# EAGLE design fishnet-0.5 (EAGLE 6.2)
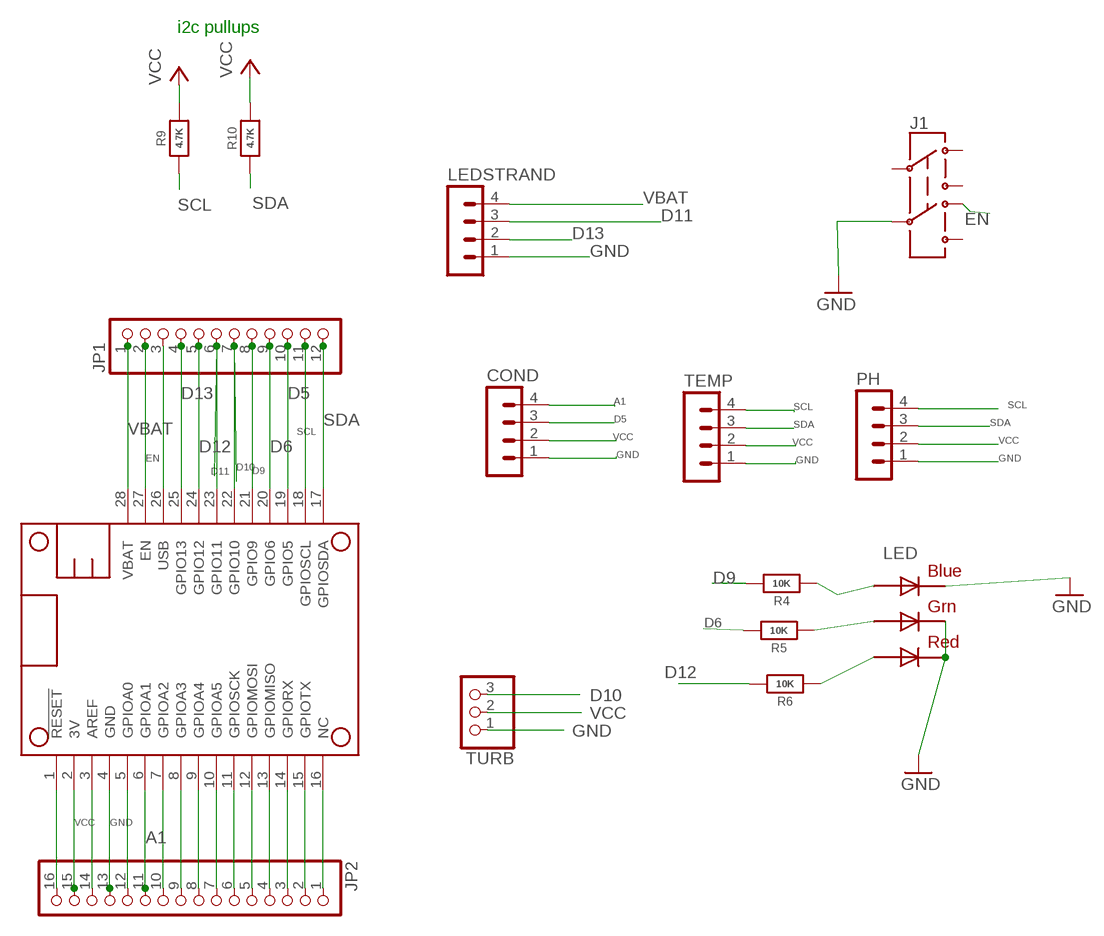
[diagram p0: schematic, sheet 1]

## Parts
COND  MA04-1  [MA04-1]
J1  AYZ0202  [AYZ0202]
JP1  PINHD-1X12  [1X12]
JP2  PINHD-1X16  [1X16]
LED  RGBLED5050  [RGBLED5050]
LEDSTRAND  MA04-1  [MA04-1]
MS1  FEATHERWING  [FEATHERWING]
PH  MA04-1  [MA04-1]
R4  10K  RESISTOR_0603_NOOUT  [0603-NO]
R5  10K  RESISTOR_0603_NOOUT  [0603-NO]
R6  10K  RESISTOR_0603_NOOUT  [0603-NO]
R9  4.7K  RESISTOR_0603_NOOUT  [0603-NO]
R10  4.7K  RESISTOR_0603_NOOUT  [0603-NO]
TEMP  MA04-1  [MA04-1]
TURB  PINHD-1X3  [1X03]

## Nets
A1: COND.4 JP2.11 MS1.6(GPIOA1)
D5: COND.3 JP1.10 MS1.19(GPIO5)
D6: JP1.9 MS1.20(GPIO6) R5.2
D9: JP1.8 MS1.21(GPIO9) R4.2
D10: JP1.7 MS1.22(GPIO10) TURB.3
D11: JP1.6 LEDSTRAND.3 MS1.23(GPIO11)
D12: JP1.5 MS1.24(GPIO12) R6.2
D13: JP1.4 LEDSTRAND.2 MS1.25(GPIO13)
EN: J1.6 JP1.2 MS1.27(EN)
GND: COND.1 J1.5 JP2.13 LED.4(BLUE_C) LED.5(RED_C) LED.6(GREEN_C) LEDSTRAND.1 MS1.4(GND) PH.1 TEMP.1 TURB.1
N$1: LED.2(RED_A) R6.1
N$2: JP2.1 MS1.16(NC)
N$3: JP2.2 MS1.15(GPIOTX)
N$4: JP2.3 MS1.14(GPIORX)
N$5: JP2.4 MS1.13(GPIOMISO)
N$6: JP2.5 MS1.12(GPIOMOSI)
N$7: JP2.6 MS1.11(GPIOSCK)
N$8: JP2.7 MS1.10(GPIOA5)
N$9: JP2.8 MS1.9(GPIOA4)
N$10: JP2.9 MS1.8(GPIOA3)
N$11: JP2.10 MS1.7(GPIOA2)
N$12: JP2.12 MS1.5(GPIOA0)
N$13: JP2.14 MS1.3(AREF)
N$14: JP2.16 MS1.1(!RESET)
N$22: LED.3(BLUE_A) R4.1
N$23: LED.1(GREEN_A) R5.1
SCL: JP1.11 MS1.18(GPIOSCL) PH.4 R9.1 TEMP.4
SDA: JP1.12 MS1.17(GPIOSDA) PH.3 R10.1 TEMP.3
USB: JP1.3 MS1.26(USB)
VBAT: JP1.1 LEDSTRAND.4 MS1.28(VBAT)
VCC: COND.2 JP2.15 MS1.2(3V) PH.2 R9.2 R10.2 TEMP.2 TURB.2
Unconnected: J1.1 J1.2 J1.3 J1.4

## Notes on the sheet
- i2c pullups

## Library data of the parts
COND LEDSTRAND PH TEMP = con-lstb:MA04-1: PIN HEADER; OC_FARNELL: unknown; OC_NEWARK: unknown
J1 = SparkFunNew:AYZ0202: SPDT Slide Switch Simple SMD single-pull double-throw slide switch. Good for less than 350mA power switch, switching UARTs between devices, etc. Spark Fun Electronics SKU : COM-00597
JP1 = pinhead:PINHD-1X12: PIN HEADER
JP2 = pinhead:PINHD-1X16: PIN HEADER
LED = adafruit:RGBLED: For 5050 RGB LEDs, the order of the LEDs may vary from one manufacturer to another!
MS1 = adafruit:FEATHERWING
R4-R6 R9 R10 = microbuilder:RESISTOR: Resistors For new designs, use the packages preceded by an '_' character since they are more reliable: The following footprints should be used on most boards: _0402 - Standard footprint for regular board layouts _0603 - Standard footprint for regular board layouts _0805 - Standard footprint for regular board layouts _1206 - Standard footprint for regular board layouts For extremely tight-pitch boards where space is at a premium, the following 'micro-pitch' footprints can be used (smaller pads, no silkscreen outline, etc.): _0402MP - Micro-pitch footprint for very dense/compact boards _0603MP - Micro-pitch footprint for very dense/compact boards _0805MP - Micro-pitch footprint for very dense/compact boards _1206MP - Micro-pitch footprint for very dense/compact boards
TURB = pinhead:PINHD-1X3: PIN HEADER

## Board
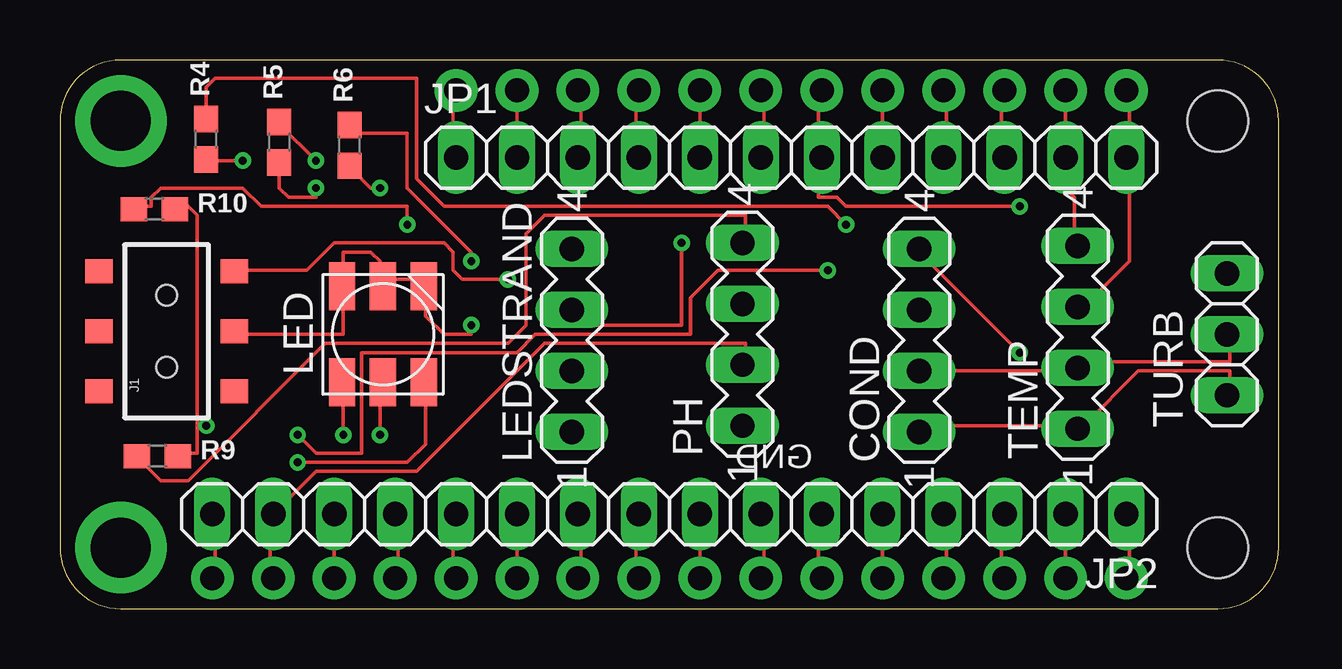
[diagram p1: board, top side]
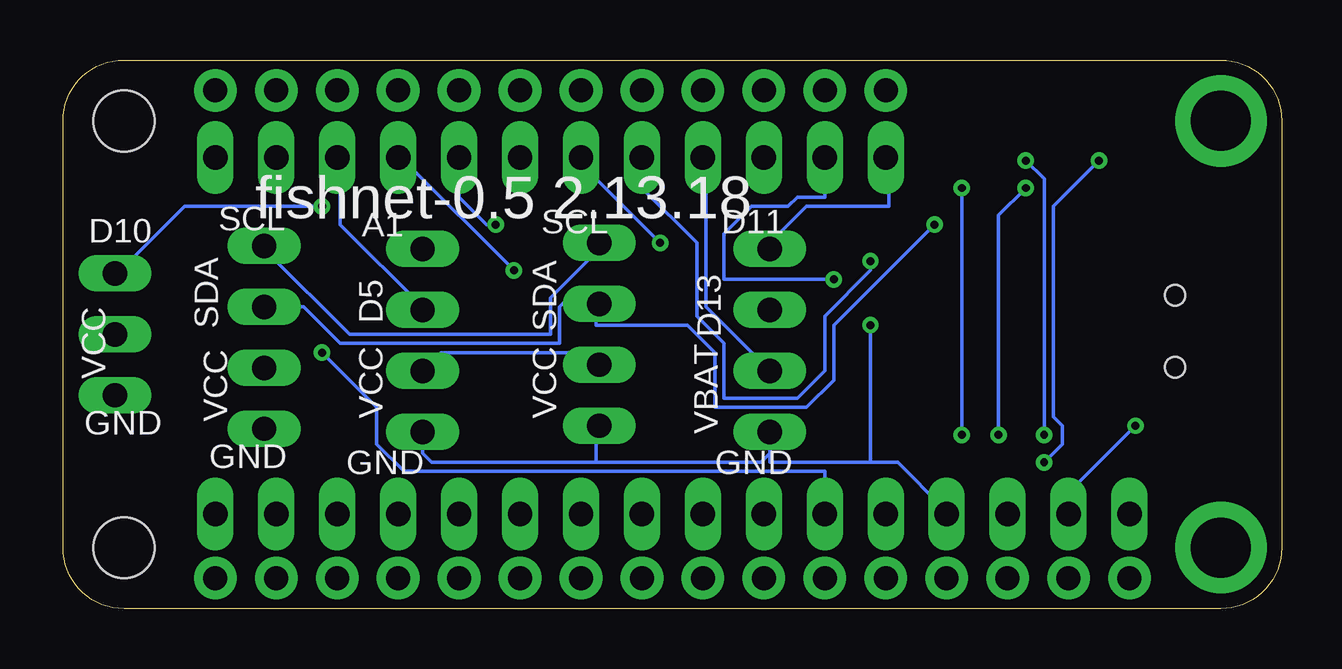
[diagram p2: board, bottom side, seen from below]

Size 50.8 x 22.86 mm. Coordinates in mm from the lower left corner, seen from the top.
Copper layers (1*16): Top 0.0356mm / dielectric 1.5011mm / Bottom 0.0356mm
Design rules: minimum track width 6mil, minimum drill 13mil, track to track 6mil, track to pad 6mil, pad to pad 6mil, via to via 6mil, smd to smd 6mil, copper to edge 15mil, drill to drill 6mil, minimum pad ring 7mil, minimum via ring 7mil, stop-mask expansion 2.5mil, vias tented up to drill 0mil, thermal gap 10mil
vRestrict: area 10.2,7.6 to 16.8,15.5; area 5.1,17.8 to 7.1,21.3; area 8.1,17.5 to 10.2,21.3; area 11.2,17 to 13,21.3; area 19.3,6.1 to 23.4,16.3; area 26.4,6.1 to 30.5,16.5; area 34,5.8 to 37.8,16.3; area 40.4,6.1 to 44.5,16.3; area 47,6.6 to 50.3,15.5; area 0.5,7.6 to 2.8,15.2; area 6.3,7.9 to 8.4,15.2; area 2,15.7 to 5.8,17.5; area 2,5.3 to 6.9,7.1

### Footprints (pad centres in the part's own frame; a part is rotated, then mirrored left to right if it is on the bottom)
MA04-1 = drill 1.016 long: 1 -3.81,0; 2 -1.27,0; 3 1.27,0; 4 3.81,0
AYZ0202 = smd 1 x 1.15: 1 -2.5,2.825; 2 0,2.825; 3 2.5,2.825; 4 -2.5,-2.825; 5 0,-2.825; 6 2.5,-2.825 | hole 0.85: 1.5,0; -1.5,0
1X12 = drill 1.016 long: 1 -13.97,0; 2 -11.43,0; 3 -8.89,0; 4 -6.35,0; 5 -3.81,0; 6 -1.27,0; 7 1.27,0; 8 3.81,0; 9 6.35,0; 10 8.89,0; 11 11.43,0; 12 13.97,0
1X16 = drill 1.016 long: 1 -19.05,0; 2 -16.51,0; 3 -13.97,0; 4 -11.43,0; 5 -8.89,0; 6 -6.35,0; 7 -3.81,0; 8 -1.27,0; 9 1.27,0; 10 3.81,0; 11 6.35,0; 12 8.89,0; 13 11.43,0; 14 13.97,0; 15 16.51,0; 16 19.05,0
RGBLED5050 = smd 2 x 1.1: 1 -2,1.7; 2 -2,0; 3 -2,-1.7; 4 2,-1.7; 5 2,0; 6 2,1.7
FEATHERWING = drill 1 pad 1.778: 1 6.35,1.27; 2 8.89,1.27; 3 11.43,1.27; 4 13.97,1.27; 5 16.51,1.27; 6 19.05,1.27; 7 21.59,1.27; 8 24.13,1.27; 9 26.67,1.27; 10 29.21,1.27; 11 31.75,1.27; 12 34.29,1.27; 13 36.83,1.27; 14 39.37,1.27; 15 41.91,1.27; 16 44.45,1.27; 17 44.45,21.59; 18 41.91,21.59; 19 39.37,21.59; 20 36.83,21.59; 21 34.29,21.59; 22 31.75,21.59; 23 29.21,21.59; 24 26.67,21.59; 25 24.13,21.59; 26 21.59,21.59; 27 19.05,21.59; 28 16.51,21.59 | drill 2.5 pad 3.81: P$1 2.54,20.32; P$2 2.54,2.54 | hole 2.54: 48.26,20.32; 48.26,2.54
0603-NO = smd 1.1 x 1: 1 -0.85,0; 2 0.85,0
1X03 = drill 1.016 long: 1 -2.54,0; 2 0,0; 3 2.54,0

### Placement (x,y rotation side)
COND  35.81,11.18 90 top
J1  4.45,11.56 90 top
JP1  30.48,18.8 0 top
JP2  25.4,3.94 180 top
LED  13.46,11.43 90 top
LEDSTRAND  21.34,11.18 90 top
MS1  0,0 0 top
PH  28.45,11.43 90 top
R4  6.1,19.56 90 top
R5  9.14,19.43 90 top
R6  12.06,19.3 90 top
R9  4.06,6.35 0 top
R10  3.94,16.64 0 top
TEMP  42.42,11.3 90 top
TURB  48.64,11.43 90 top

### Tracks (layer width: path | path; a pad name or v marks a point on that pad's centre or on a via)
A1  (via drill 0.33)
  Top 0.152: MS1.6 JP2.11 | v40.01,10.67 35.81,14.86 COND.4
  Bottom 0.152: v40.01,10.67 37.72,8.38 37.72,6.86 36.58,5.71 19.05,5.71 JP2.11
D5
  Top 0.152: MS1.19 39.24,21.34 39.24,19.05 JP1.10
  Bottom 0.152: COND.3 35.81,12.57 39.24,16 39.24,18.67 JP1.10
D6  (via drill 0.33)
  Top 0.152: v10.67,18.67 9.14,20.19 R5.2 | v9.91,7.24 10.67,6.48 12.57,6.48 12.57,10.67 19.05,10.67 19.81,11.43 26.29,11.43 26.29,12.95 27.43,14.1 v32,14.1 | MS1.20 36.96,21.34 36.96,19.05 JP1.9
  Bottom 0.152: v10.67,18.67 9.91,17.91 v9.91,7.24 | v32,14.1 36.58,18.67 JP1.9
D9  (via drill 0.33)
  Top 0.152: R4.2 6.1,21.72 6.48,22.1 14.86,22.1 14.86,17.91 16,16.76 32,16.76 v32.77,16 | JP1.8 MS1.21
  Bottom 0.152: v32.77,16 33.15,16 34.29,17.14 JP1.8
D10  (via drill 0.33)
  Top 0.152: MS1.22 31.62,21.34 31.62,19.05 JP1.7 31.62,18.67 31.62,17.14 32.38,17.14 32.77,16.76 v40.01,16.76
  Bottom 0.152: v40.01,16.76 45.72,16.76 48.39,14.1 TURB.3
D11  (via drill 0.33)
  Top 0.152: v25.91,15.24 25.91,11.81 21.72,11.81 21.34,12.19 LEDSTRAND.3 | MS1.23 29.34,21.34 29.34,19.05 JP1.6
  Bottom 0.152: v25.91,15.24 28.96,18.29 28.96,18.67 JP1.6
D12  (via drill 0.33)
  Top 0.152: v17.14,14.48 17.14,14.86 14.48,17.53 14.48,19.81 12.19,19.81 R6.2 | JP1.5 MS1.24
  Bottom 0.152: v17.14,14.48 17.14,14.1 19.05,12.19 19.05,9.91 20.19,8.76 23.24,8.76 23.24,11.05 24.38,12.19 24.38,15.24 26.67,17.53 JP1.5
D13
  Top 0.152: MS1.25 24,21.34 24,19.05 JP1.4
  Bottom 0.152: LEDSTRAND.2 24,12.57 24,18.67 JP1.4
EN  (via drill 0.33)
  Top 0.152: v18.67,13.72 16.76,13.72 16.38,14.1 16.38,14.86 16,15.24 11.43,15.24 10.29,14.1 7.62,14.1 J1.6 | JP1.2 MS1.27
  Bottom 0.152: v18.67,13.72 23.24,13.72 23.24,15.62 22.1,16.76 20.57,16.76 20.19,17.14 19.05,17.14 JP1.2
GND  (via drill 0.33)
  Top 0.152: TURB.1 48.77,9.14 48.77,9.91 44.96,9.91 42.67,7.62 TEMP.1 42.29,7.62 35.81,7.62 COND.1 | J1.5 7.62,11.43 11.81,11.43 11.81,13.34 LED.6 11.81,13.72 11.81,14.86 12.95,14.86 13.34,14.48 13.34,13.72 LED.5 13.72,13.72 14.86,13.72 LED.4 15.24,13.34 15.24,12.19 16,11.43 17.14,11.43 v17.14,11.81 | JP2.13 14.1,3.81 14.1,1.52 MS1.4
  Bottom 0.152: 21.34,6.48 LEDSTRAND.1 | 21.34,6.48 21.72,6.1 28.57,6.1 | 28.57,6.1 28.57,7.62 PH.1 | COND.1 35.81,6.48 35.43,6.1 28.57,6.1 | 17.14,6.1 21.34,6.1 21.34,6.48 | 17.14,6.1 16,6.1 14.1,4.19 JP2.13 | 17.14,6.1 v17.14,11.81
N$1  (via drill 0.33)
  Top 0.152: v13.34,17.53 12.95,17.53 12.19,18.29 R6.1 | v13.34,7.24 13.34,9.14 LED.2
  Bottom 0.152: v13.34,7.24 v13.34,17.53
N$2
  Top 0.152: JP2.1 44.58,3.81 44.58,1.52 MS1.16
N$3
  Top 0.152: MS1.15 JP2.2
N$4
  Top 0.152: JP2.3 39.24,3.81 39.24,1.52 MS1.14
N$5
  Top 0.152: JP2.4 36.96,3.81 36.96,1.52 MS1.13
N$6
  Top 0.152: MS1.12 JP2.5
N$7
  Top 0.152: JP2.6 31.62,3.81 31.62,1.52 MS1.11
N$8
  Top 0.152: JP2.7 29.34,3.81 29.34,1.52 MS1.10
N$9
  Top 0.152: MS1.9 JP2.8
N$10
  Top 0.152: JP2.9 24,3.81 24,1.52 MS1.8
N$11
  Top 0.152: JP2.10 21.72,3.81 21.72,1.52 MS1.7
N$12
  Top 0.152: JP2.12 16.38,3.81 16.38,1.52 MS1.5
N$13
  Top 0.152: MS1.3 JP2.14
N$14
  Top 0.152: JP2.16 6.48,3.81 6.48,1.52 MS1.1
N$22  (via drill 0.33)
  Top 0.152: v7.62,18.67 6.1,18.67 R4.1 | v9.91,6.1 14.48,6.1 15.24,6.86 15.24,9.14 LED.3
  Bottom 0.152: v7.62,18.67 9.53,16.76 9.53,8 9.14,7.62 9.14,6.86 v9.91,6.1
N$23  (via drill 0.33)
  Top 0.152: R5.1 9.14,17.53 9.53,17.14 10.67,17.14 v10.67,17.53 | v11.81,7.24 11.81,9.14 LED.1
  Bottom 0.152: v10.67,17.53 11.81,16.38 v11.81,7.24
SCL
  Top 0.152: MS1.18 JP1.11 41.91,17.53 42.29,17.14 42.29,15.24 TEMP.4 | R9.1 3.43,6.1 4.19,5.33 5.33,5.33 11.05,11.05 18.67,11.05 19.43,11.81 19.43,15.62 20.19,16.38 28.57,16.38 28.57,15.24 PH.4
  Bottom 0.152: TEMP.4 42.29,14.86 38.86,11.43 30.48,11.43 30.48,12.95 28.57,14.86 28.57,15.24 PH.4
SDA  (via drill 0.33)
  Top 0.152: TEMP.3 42.67,12.57 44.58,14.48 44.58,18.67 JP1.12 44.58,19.05 44.58,21.34 MS1.17 | v14.48,16 14.48,16.76 8.38,16.76 7.62,17.53 4.19,17.53 3.81,17.14 3.81,16.76 3.43,16.76 R10.1
  Bottom 0.152: v14.48,16 18.67,11.81 18.67,9.53 19.81,8.38 23.62,8.38 23.62,10.67 24.77,11.81 28.57,11.81 28.57,12.57 PH.3 28.57,12.95 28.57,13.34 29.34,13.34 30.1,12.57 30.1,11.05 39.24,11.05 40.77,12.57 TEMP.3
USB
  Top 0.152: JP1.3 21.72,19.05 21.72,21.34 MS1.26
VBAT
  Top 0.152: MS1.28 16.38,21.34 16.38,19.05 JP1.1
  Bottom 0.152: LEDSTRAND.4 21.34,15.24 19.81,16.76 16.38,16.76 16.38,18.67 JP1.1
VCC  (via drill 0.33)
  Top 0.152: MS1.2 8.76,1.52 8.76,3.81 JP2.15 10.67,5.71 14.86,5.71 20.19,11.05 28.57,11.05 28.57,10.29 PH.2 | 5.71,7.62 5.71,16.38 5.33,16.76 4.95,16.76 R10.2 | 5.71,7.62 5.71,6.48 4.95,6.48 R9.2 | 5.71,7.62 v6.1,7.62 | TURB.2 48.77,11.43 48.77,10.29 42.67,10.29 TEMP.2 42.29,9.91 COND.2
  Bottom 0.152: v6.1,7.62 8.76,4.95 8.76,4.19 JP2.15 | COND.2 35.05,10.67 28.57,10.67 28.57,10.29 PH.2

### Text on the board
tNames: GND
bNames: D11 | SCL | fishnet-0.5 2.13.18 | SCL | D10 | A1 | D5 | VCC | SDA | SDA | D13 | VBAT | VCC | VCC | VCC | GND | GND | GND | GND